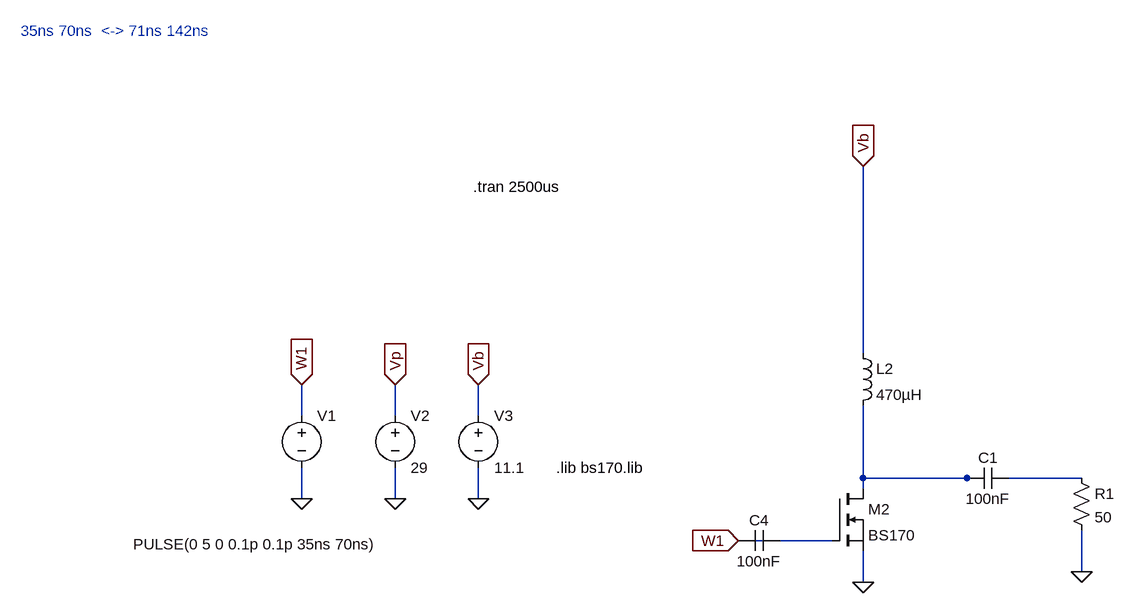
[diagram p0: schematic BS170-Driver.asc]
BS170-Driver.asc, the LTspice schematic file:
Version 4
SHEET 1 1332 680
WIRE 192 -256 192 -544
WIRE -672 -160 -672 -208
WIRE -528 -160 -528 -208
WIRE -400 -160 -400 -208
WIRE 192 -64 192 -176
WIRE 352 -64 192 -64
WIRE 368 -64 352 -64
WIRE 528 -64 416 -64
WIRE 192 -48 192 -64
WIRE -672 -32 -672 -80
WIRE -528 -32 -528 -80
WIRE -400 -32 -400 -80
WIRE 48 32 0 32
WIRE 144 32 64 32
WIRE 528 80 528 16
WIRE 192 96 192 48
FLAG 0 32 W1
IOPIN 0 32 In
FLAG -672 -32 0
FLAG -528 -32 0
FLAG -672 -208 W1
IOPIN -672 -208 In
FLAG -528 -208 Vp
IOPIN -528 -208 In
FLAG 528 80 0
FLAG -400 -32 0
FLAG -400 -208 Vb
IOPIN -400 -208 In
FLAG 192 -544 Vb
IOPIN 192 -544 In
FLAG 192 96 0
SYMBOL voltage -672 -176 R0
WINDOW 3 -259 214 Left 2
WINDOW 123 0 0 Left 0
WINDOW 39 0 0 Left 0
SYMATTR Value PULSE(0 5 0 0.1p 0.1p 35ns 70ns)
SYMATTR InstName V1
SYMBOL voltage -528 -176 R0
WINDOW 123 0 0 Left 0
WINDOW 39 0 0 Left 0
SYMATTR InstName V2
SYMATTR Value 29
SYMBOL cap 416 -80 R90
WINDOW 0 0 32 VBottom 2
WINDOW 3 32 32 VTop 2
SYMATTR InstName C1
SYMATTR Value 100nF
SYMBOL nmos 144 -48 R0
SYMATTR InstName M2
SYMATTR Value BS170
SYMATTR Prefix X
SYMBOL cap 64 16 R90
WINDOW 0 0 32 VBottom 2
WINDOW 3 32 32 VTop 2
SYMATTR InstName C4
SYMATTR Value 100nF
SYMBOL voltage -400 -176 R0
WINDOW 123 0 0 Left 0
WINDOW 39 0 0 Left 0
SYMATTR InstName V3
SYMATTR Value 11.1
SYMBOL ind 176 -272 R0
SYMATTR InstName L2
SYMATTR Value 470µH
SYMBOL res 512 -80 R0
SYMATTR InstName R1
SYMATTR Value 50
TEXT -280 -80 Left 2 !.lib bs170.lib
TEXT -408 -512 Left 2 !.tran 2500us
TEXT -1104 -752 Left 2 ;35ns 70ns  <-> 71ns 142ns

The netlist it stands for:
* BS170-Driver.asc
V1 W1 0 PULSE(0 5 0 0.1p 0.1p 35ns 70ns)
V2 Vp 0 29
C1 N002 N001 100nF
XM2 N001 N003 0 BS170  ; pins D G S
C4 N003 W1 100nF
V3 Vb 0 11.1
L2 Vb N001 470µH
R1 N002 0 50
.lib bs170.lib
.tran 2500us
* 35ns 70ns  <-> 71ns 142ns
.backanno
.end